# Altium project STEP_DRIVER_V3.0.PrjPcb (part 2 of 2)
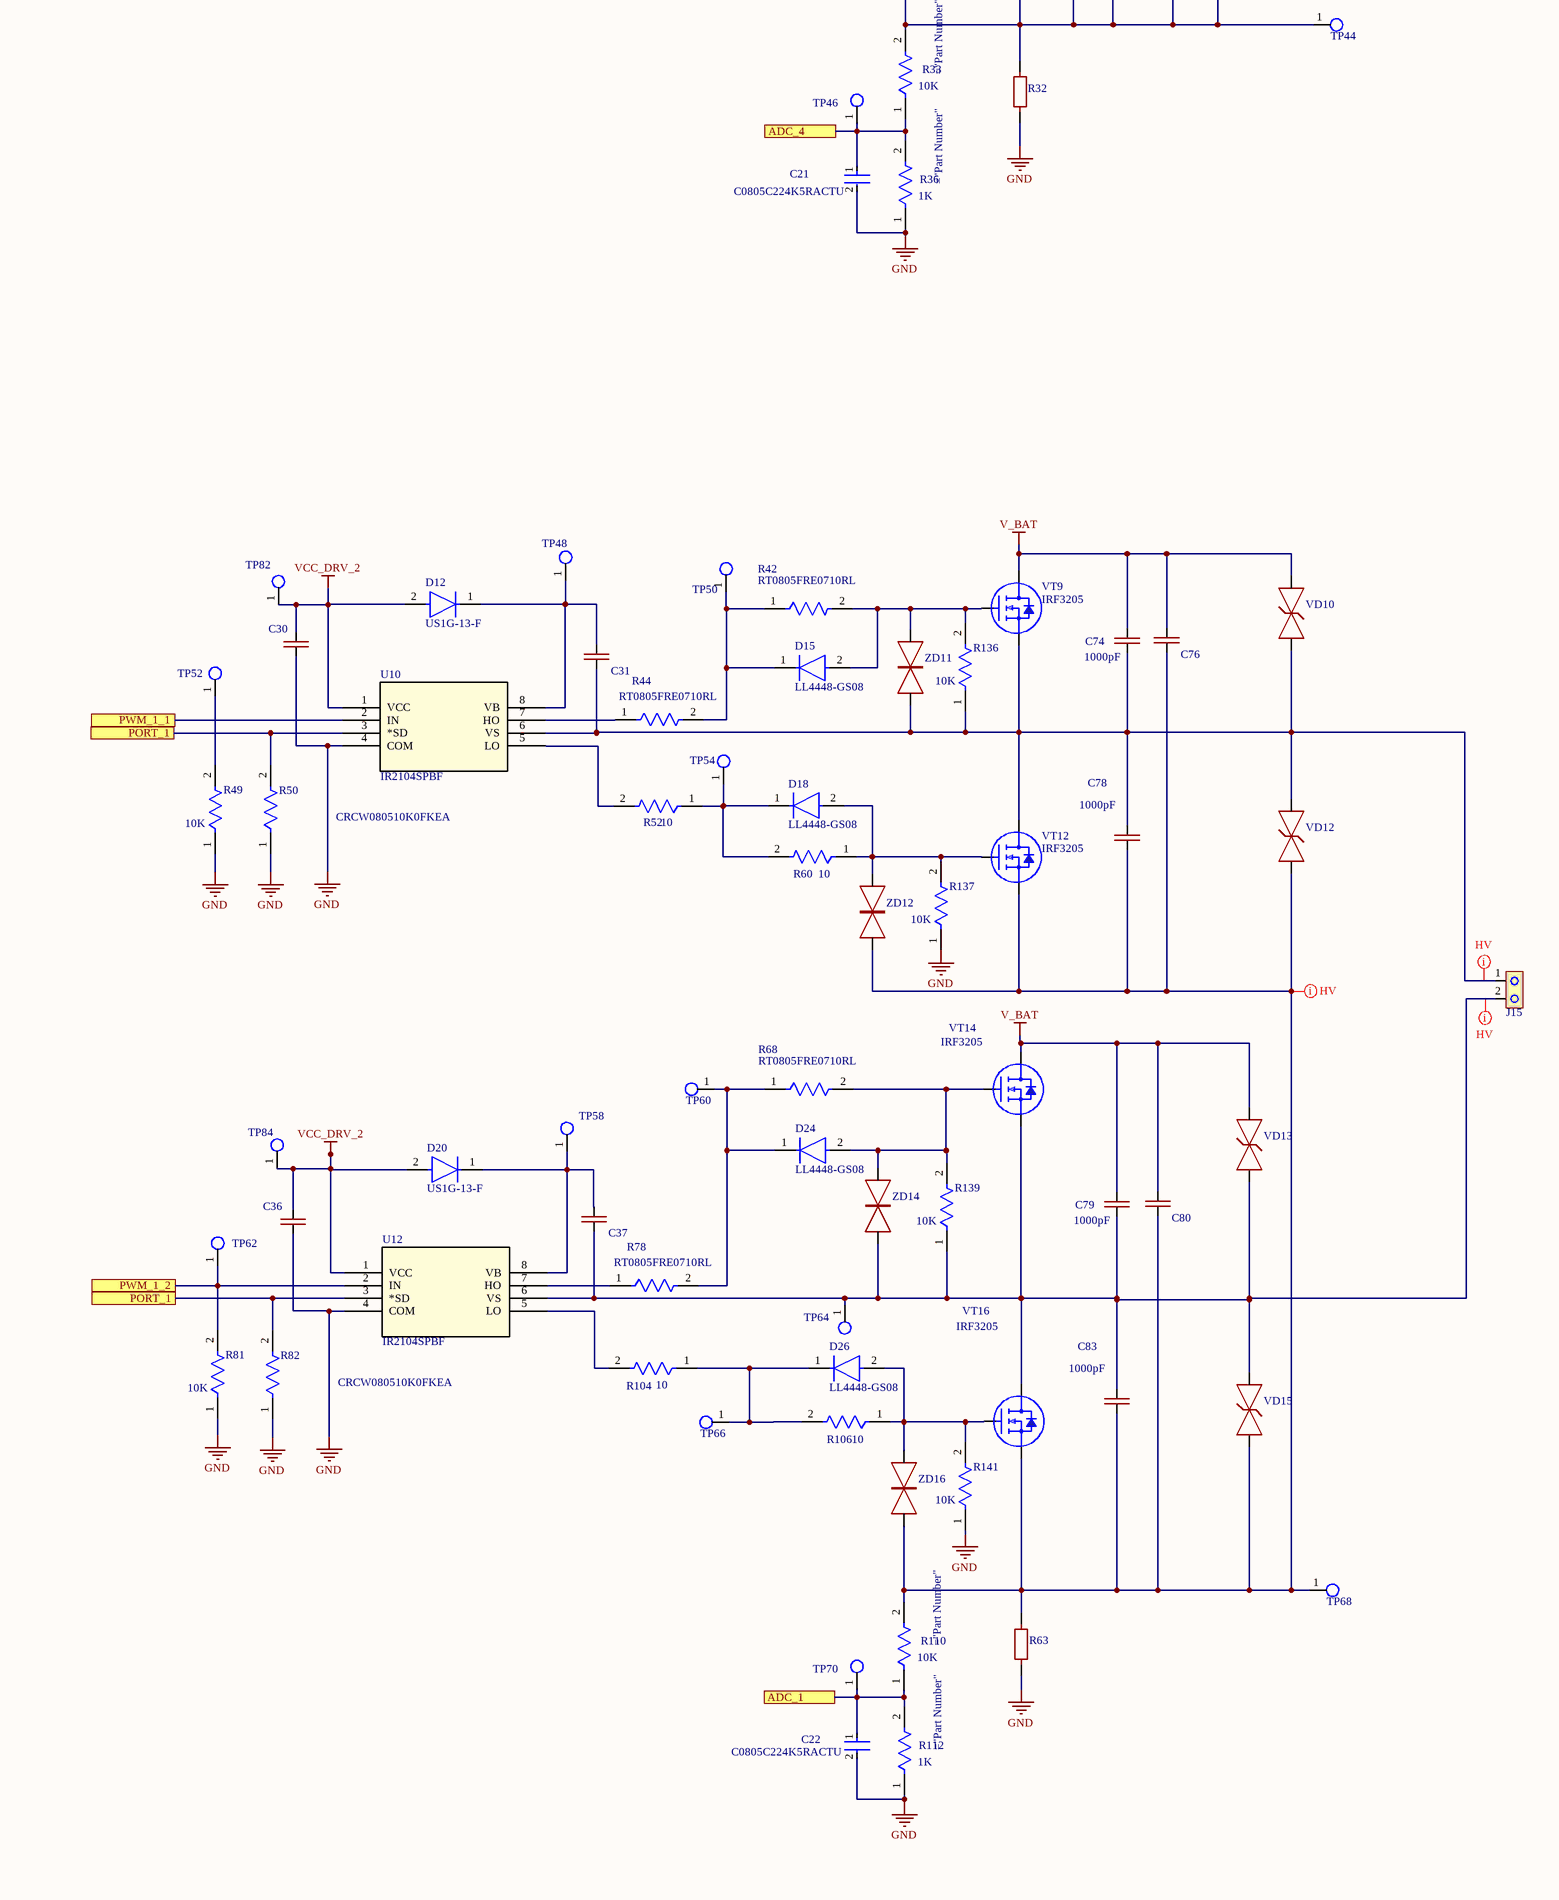
[diagram p8: STEP_DRIVER_V3.0.SchDoc, bottom column 4 of 4]

## Sheet STEP_DRIVER_V3.0.SchDoc (continued)

### Notes on the sheet
- (in symbol ACS758) VCC
- (in symbol CMP-05427-000015-1) +
- (in symbol MCP6001T) +; -

### Library data of the parts
C1 C2 C45 C57 C58 C90 C91 = 1000uF_10V_Size_F
C3 = CMP-05427-000015-1: CAP ALUM 100UF 20% 50V SMD; Manufacturer: Panasonic; Automotive Grade: Grade 3; Leakage Current: 100uA; Dissipation Factor: 0.12%; Life: 2000Hours; Ripple Current: 200mA; Material: Aluminum; ComponentLink2Description: Datasheet; Category: Cap; Voltage Rating: 50V; Value: 100uF; Octopart: https://octopart.com/eee-1ha101up-panasonic-55396734; Digikey Description: CAP ALUM 100UF 20% 50V SMD; Package: SF; RoHS: TRUE; Height: 10.5mm; ComponentLink2URL: https://industrial.panasonic.com/cdbs/www-data/pdf/RDE0000/ABA0000C1145.pdf; Tolerance: 20%; Mouser Description: Cap Aluminum Lytic 100uF 50V 20% (8 X 10.2mm) SMD 200mA 2000h 85C Automotive T/R; Device Class L2: Capacitors; Temperature Range High: +85°C; Lead Free: Yes; Device Class L3: Aluminum Electrolytic Capacitors; Device Class L1: Passive Components; Manufacturer Part Number: EEE-1HA101UP; Temperature: -40°C to +85°C; Automotive: Yes; Capacitance: 100uF; Voltage: 50V; Temperature Range Low: -40°C
C4 C5 C88 = CAP-POLAR
C6 C61-C64 = 293D106X9050E2TE3: Capacitor Polarised; Manufacturer_Name: Vishay; Height: 4.3mm; Manufacturer_Part_Number: 293D106X9050E2TE3; Mouser Part Number: 74-293D106X9050E2TE3; Arrow Part Number: 293D106X9050E2TE3
  C6: Datasheet Link: http://www.vishay.com/doc?40002; Mouser Price/Stock: https://www.mouser.com/Search/Refine.aspx?Keyword=74-293D106X9050E2TE3; Arrow Price/Stock: https://www.arrow.com/en/products/293d106x9050e2te3/vishay
  C61-C64: Datasheet Link: http://www.vishay.com/docs/40002/293d.pdf; Mouser Price/Stock: https://www.mouser.co.uk/ProductDetail/Vishay-Sprague/293D106X9050E2TE3?qs=N31o%252Bt096gu9lsvzLRhHsg%3D%3D; Arrow Price/Stock: https://www.arrow.com/en/products/293d106x9050e2te3/vishay?region=nac
C7 C33 C48 C55 C56 C60 C70 C72-C74 C77-C79 C81 C83 C84 C86 C87 = CAP-NON-POLAR
C8 C10 C17-C23 C26-C28 C40 C46 C49 C51 C53 C59 C65-C68 C85 C89 C92-C96 = CMP-1036-04552-2: CAP CER 0.22UF 50V X7R 0805; Manufacturer: KEMET; Value: 0.22 μF; Temperature Coefficient: 30ppm/°C; Material: Ceramic; Tolerance: 0.1; ComponentLink2URL: https://content.kemet.com/datasheets/KEM_C1003_C0G_SMD.pdf; Temperature Characteristic: X7R; Device Class L3: Ceramic Capacitors; Lead Free: Yes; Temperature: -55°C to +125°C; RoHS: TRUE; Capacitance: 0.22 μF; Automotive: No; Octopart: https://octopart.com/c0805c224k5ractu-kemet-144670; Manufacturer Part Number: C0805C224K5RACTU; Temperature Range Low: -55°C; Height: 0.88mm; Device Class L1: Passive Components; Digikey Description: CAP CER 0.22UF 50V X7R 0805; ComponentLink2Description: Datasheet; Mouser Description: CAP CER 0.22UF 50V X7R 0805; Category: Cap; Ipc Land Pattern Name: CAPC200125X78; Temperature Range High: +125°C; Package: C0805C-DN; Device Class L2: Capacitors; Voltage Rating: 50 V
C42 = CMP-00287-17080245-1: ECQ-E2224JFW ECQE, Met Polyester Film Cap Radial Lead 250VDC, 0.22uF, 5%, L/S =10mm, Blk CRMP; Capacitance: 220nF; Voltage Rating (DC): 250V; Dielectric: PET; NexarPartId: 17080245; Width: 5.5118mm; Length: 11.9888mm; Min Operating Temperature: -40°C; Termination: Radial; Height - Seated (Max): 15.494mm; Max Operating Temperature: 105°C; Lead Pitch: 10mm; Mount: Through Hole; RoHS: Compliant; Dielectric Material: Polyester; Tolerance: 5%; Case/Package: Radial
C43 = CMP-1036-04552-2: CAP CER  2.2UF 50V X7R 0805; Manufacturer: KEMET; Manufacturer Part Number: C0805C224K5RACTU; Value: 0.22 μF; Temperature Coefficient: 30ppm/°C; Material: Ceramic; Tolerance: 0.1; ComponentLink2URL: https://content.kemet.com/datasheets/KEM_C1003_C0G_SMD.pdf; Temperature Characteristic: X7R; Device Class L3: Ceramic Capacitors; Lead Free: Yes; Temperature: -55°C to +125°C; RoHS: TRUE; Capacitance: 0.22 μF; Automotive: No; Octopart: https://octopart.com/c0805c224k5ractu-kemet-144670; Temperature Range Low: -55°C; Height: 0.88mm; Device Class L1: Passive Components; Digikey Description: CAP CER 0.22UF 50V X7R 0805; ComponentLink2Description: Datasheet; Mouser Description: CAP CER 0.22UF 50V X7R 0805; Category: Cap; Ipc Land Pattern Name: CAPC200125X78; Temperature Range High: +125°C; Package: C0805C-DN; Device Class L2: Capacitors; Voltage Rating: 50 V
C44 = CMP-1036-04552-2: CAP CER 2.2UF 50V X7R 0805; Manufacturer: KEMET; Manufacturer Part Number: C0805C224K5RACTU; Value: 0.22 μF; Temperature Coefficient: 30ppm/°C; Material: Ceramic; Tolerance: 0.1; ComponentLink2URL: https://content.kemet.com/datasheets/KEM_C1003_C0G_SMD.pdf; Temperature Characteristic: X7R; Device Class L3: Ceramic Capacitors; Lead Free: Yes; Temperature: -55°C to +125°C; RoHS: TRUE; Capacitance: 0.22 μF; Automotive: No; Octopart: https://octopart.com/c0805c224k5ractu-kemet-144670; Temperature Range Low: -55°C; Height: 0.88mm; Device Class L1: Passive Components; Digikey Description: CAP CER 0.22UF 50V X7R 0805; ComponentLink2Description: Datasheet; Mouser Description: CAP CER 0.22UF 50V X7R 0805; Category: Cap; Ipc Land Pattern Name: CAPC200125X78; Temperature Range High: +125°C; Package: C0805C-DN; Device Class L2: Capacitors; Voltage Rating: 50 V
C47 C50 C52 C54 = CMP-1036-04552-2: CAP CER 0.22UF 50V X7R 0805; Manufacturer: KEMET; Manufacturer Part Number: C0805C224K5RACTU; Value: 0.22 μF; Temperature Coefficient: 30ppm/°C; Material: Ceramic; Tolerance: 0.1; ComponentLink2URL: https://content.kemet.com/datasheets/KEM_C1003_C0G_SMD.pdf; Temperature Characteristic: X7R; Device Class L3: Ceramic Capacitors; Lead Free: Yes; Temperature: -55°C to +125°C; RoHS: TRUE; Capacitance: 0.22 μF; Automotive: No; Octopart: https://octopart.com/c0805c224k5ractu-kemet-144670; Temperature Range Low: -55°C; Height: 0.88mm; Device Class L1: Passive Components; Digikey Description: CAP CER 0.22UF 50V X7R 0805; ComponentLink2Description: Datasheet; Mouser Description: CAP CER 0.22UF 50V X7R 0805; Category: Cap; Ipc Land Pattern Name: CAPC200125X78; Temperature Range High: +125°C; Package: C0805C-DN; Device Class L2: Capacitors; Voltage Rating: 50 V
D1 D2 D6 D10-D12 D19 D20 = CMP-12791-000009-1: DIODE GEN PURP 400V 1A SMA; Manufacturer: Diodes Inc.; Max Surge Forward Current: 30A; Peak Reverse Current: 5uA; Standoff Height: 0.05mm; Value: 20pF; Max Junction Temp: +150°C; Digikey Description: DIODE GEN PURP 400V 1A SMA; ComponentLink2URL: https://www.diodes.com/assets/Datasheets/ds16008.pdf; Device Class L1: Discrete Semiconductors; Mouser Description: Rectifiers 400V 1A; Manufacturer Part Number: US1G-13-F; Package: SMA; Height: 2.4mm; Automotive: No; Temperature Range High: +150°C; RoHS: TRUE; Lead Free: Yes; Temperature: -65°C to +150°C; Category: Diode; Octopart: https://octopart.com/us1g-13-f-diodes+inc.-334651; Temperature Range Low: -65°C; Forward Current: 1A; Footprint Url: https://www.diodes.com/assets/Package-Files/SMA.pdf; ComponentLink2Description: Datasheet; Reverse Voltage: 400V; Capacitance: 20pF; Device Class L3: Rectifier Diodes; Max Repetitive Reverse Voltage: 400V; Device Class L2: Diodes
D3-D5 D7-D9 D13-D18 D21 D24-D27 = CMP-249167-000001-1: DIODE GEN PURP 75V 150MA SOD80; Manufacturer: Vishay Small Signal; Max Junction Temp: +175°C; Automotive Grade: Grade 0; Capacitance: 4pF; Peak Reverse Current: 5uA; Forward Current: 300mA; Max Repetitive Reverse Voltage: 100V; Max Surge Forward Current: 2A; Value: 4pF; ComponentLink2Description: Datasheet; Height: 1.6mm; ComponentLink2URL: http://www.vishay.com/docs/85557/ll4148.pdf; Category: Diode; Lead Free: Yes; Device Class L3: Rectifier Diodes; Reverse Voltage: 75V; Mouser Description: Diodes - General Purpose, Power, Switching 100 Volt 100mA; RoHS: TRUE; Temperature: to +175°C; Automotive: Yes; Octopart: https://octopart.com/ll4448-gs08-vishay+small+signal-40886; Digikey Description: DIODE GEN PURP 75V 150MA SOD80; Manufacturer Part Number: LL4448-GS08; Temperature Range High: +175°C; Device Class L1: Discrete Semiconductors; Device Class L2: Diodes; Package: 6.560-5005.01-4
D22 D28-D31 = 151031YS06000: WURTH ELEKTRONIK - 151031YS06000 - LED, Yellow, Through Hole, T-1 (3mm), 30 mA, 2 V, 590 nm; Geometry.Height: 5.5mm; Manufacturer_Name: Wurth Elektronik; Manufacturer_Part_Number: 151031YS06000; Mouser Part Number: 710-151031YS06000; Mouser Price/Stock: https://www.mouser.co.uk/ProductDetail/Wurth-Elektronik/151031YS06000?qs=LlUlMxKIyB3xSYYW%252BcuBiQ%3D%3D; Arrow Part Number: *; Arrow Price/Stock: *; Mouser Testing Part Number: *; Mouser Testing Price/Stock: *; Datasheet Link: https://katalog.we-online.de/led/datasheet/151031YS06000.pdf
D23 = LMV358AIDR: Микросхема сдвоенный ОУ; ComponentDescription: =ComponentTypе+', '+Comment+', '+Package; ComponentTypе: Микросхема сдвоенный ОУ; Package: 8-SOIC
D32 = CMP-02541-000001-1: DIODE ZENER 15V 1.3W DO41; Manufacturer: Vishay; Max Reverse Leakage Current: 0.5uA; Reverse Voltage: 11V; Max Zener Voltage: 15.6V; Zener Impedance: 15Ω; Max Junction Temp: +175°C; Power Dissipation: 1300mW; Automotive Grade: Grade 0; Device Class L3: Zener Diodes; Device Class L1: Discrete Semiconductors; Automotive: Yes; Mouser Description: Zener Diodes 15 Volt 1.3 Watt 5%; Lead Free: Yes; Height: 2.6mm; Octopart: https://octopart.com/bzx85c15-tap-vishay-55401762; Temperature: to +175°C; Digikey Description: DIODE ZENER 15V 1.3W DO41; ComponentLink2URL: http://www.vishay.com/docs/85607/bzx85.pdf; Device Class L2: Diodes; RoHS: TRUE; Temperature Range High: +175°C; ComponentLink2Description: Datasheet; Package: 6.561-5001.02-4; Manufacturer Part Number: BZX85C15-TAP; Category: Diode; Nom Zener Voltage: 15V
D33 = CMP-14400-000025-1: DIODE ZENER 5.1V 300MW SOD323
J1 J2 J4 J13 = 691101710002: WR-TBL Series 101 Horizontal Entry Modular, THT, pitch 5mm, 2p; Manufacturer: Wurth Elektronik; Modularity: Yes; Rated Current: 16A; Working Voltage: 250V; ComponentLink1Description: Website Link; ComponentLink1URL: https://www.we-online.com/redexpert/article/691101710002?ad; ComponentLink2Description: Datasheet Link; ComponentLink2URL: https://www.we-online.com/redexpert/spec/691101710002?ad; Manufacturer Part Number: 691101710002; Category: Terminal Blocks; Match Code: WR-TBL; Mount: Through Hole; Operating Temperature Max: 105°C; Operating Temperature Min: -40°C; Packaging: Box; Application: Pressure Clamp; Number of Pins: 2; Number of Rows: 1; Orientation: Horizontal; Pitch: 5mm
J3 J8-J10 J15 = Connector_Tianli_T-800
J5 = 691101710003: WR-TBL Series 101 Horizontal Entry Modular, Through Hole, pitch 5mm, 3p; Manufacturer: Wurth Elektronik; Pin Number: 3; Rated Current: 16A; Working Voltage: 250V; PCB/Cable/Panel: PCB; Modularity: Yes; ComponentLink1Description: Manufacturer Link; ComponentLink1URL: https://www.we-online.com/redexpert/article/691101710003?ad; ComponentLink2Description: Datasheet; ComponentLink2URL: https://www.we-online.com/redexpert/spec/691101710003?ad; Category: Terminal Blocks; Match Code: WR-TBL; Manufacturer Part Number: 691101710003; Mount: Through Hole; Operating Temperature Max: 105°C; Operating Temperature Min: -40°C; Packaging: Box; Pitch: 5mm; Orientation: Horizontal; Application: Pressure Clamp
L1 L4-L9 = CMP-0227-00501-2: NexarPartId: 24533346; Inductance: 270µH; Current Rating: 620mA; Self Resonant Frequency: 4MHz; DC Resistance (DCR): 500mΩ; Ambient Temperature Range Low: -40°C; Min Operating Temperature: -40°C; RoHS: Compliant; Ambient Temperature Range High: 85°C; Packaging: Digi-Reel®; Height: 5.4mm; Length: 9mm; Max Operating Temperature: 125°C; Width: 10mm
LED3 LED4 = 151033BS03000: THT LED round mono-color waterclear, WL-TMRW , Blue; Manufacturer: Wuerth Elektronik; ComponentLink1Description: Manufacturer URL; ComponentLink2Description: Datasheet; ComponentLink1URL: http://www.we-online.com; ComponentLink2URL: http://katalog.we-online.de/pbs/datasheet/7448042001.pdfhttp://katalog.we-online.de/pbs/datasheet/7448042001.pdfhttp://katalog.we-online.de/pbs/datasheet/7448042001.pdfhttp://katalog.we-online.de/pbs/datasheet/151033BS03000.pdf; PartNumber: 151033BS03000; Emitting color: Blue; PackageReference: Type 3mm
P1 = CMP-1024-00357-1: 0.025" SQ Post Header, Through-hole, Vertical, -55 to 125 degC, 2.54 mm Pitch, 4-Pin, Male, RoHS; Manufacturer: Samtec; Pitch: 2.54 mm; RoHS: True; ComponentLink3URL: http://www.samtec.com/documents/webfiles/cpdf/TSW-XXX-XX-XXX-X-XX-XXX-MKT.pdf; Mounting Technology: Through-hole; ComponentLink2URL: http://www.samtec.com/documents/webfiles/pdf/TSW_TH.PDF; ComponentLink1URL: http://www.samtec.com; ComponentLink3Description: Package Specification; PackageVersion: DM, 8/1988; ComponentLink2Description: Datasheet; PackageReference: TSW-104-08-X-S; PackageDescription: .025[0.64] SQ. Post Terminal Strip Assembly; PartNumber: TSW-104-08-G-S; ComponentLink1Description: Manufacturer URL; Temperature Range: -55 to 125 degC; DatasheetVersion: F-214; Orientation: Vertical
P2 P4 P8-P11 = 61900311121: WR-WTB THT Male Vertical Locking Header, pitch 2.54mm, 3p; Pin Number: 3; Contact Resistance: 20mOhm; Rated Current: 3A; Withstanding Voltage: 1000VAC; Working Voltage: 250VAC; ComponentLink1Description: Manufacturer; ComponentLink1URL: http://www.we-online.de; ComponentLink2Description: Datasheet; ComponentLink2URL: https://www.we-online.com/catalog/datasheet/61900311121.pdf; Pitch: 2.54mm; Published Date: January 2020; Publisher: Wurth Elektronik; Mounting Technology: THT; Packaging: Bag; Operating Temperature: -40 to +105degC; Part Number: 61900311121; Gender: Male; Type: Vertical
P12-P14 = 61300511121: WR-PHD Pin Header, THT, Vertical, pitch 2.54mm, 1 Row, 5P; Manufacturer: Wurth Elektronik; Contact Resistance: 20mΩ; Rated Current: 3A; Working Voltage: 250V; Withstanding Voltage: 500V; ComponentLink1Description: Website Link; ComponentLink1URL: https://www.we-online.com/redexpert/article/61300511121?ad; ComponentLink2Description: Datasheet Link; ComponentLink2URL: https://www.we-online.com/redexpert/spec/61300511121?ad; Manufacturer Part Number: 61300511121; Category: Board-to-Board Connectors; Match Code: WR-PHD; Mount: Through Hole; Operating Temperature Max: 105°C; Operating Temperature Min: -40°C; Packaging: Bag; Gender: Pin Header; Number of Pins: 5; Number of Rows: 1; Orientation: Vertical; Pitch: 2.54mm
R1 = RES-CONST
R2 R10 R15 R16 R25-R28 R45 R48 R51 R52 R59 R60 R83-R88 R93 R94 R97 R99-R106 = CRCW08050000Z0EA
  R15 R16 R25-R28 R45 R48 R51 R52 R59 R60 R83 R84 R103-R106: 100k: *
  R85-R88 R93 R94 R97 R99-R102: 10k: *
R3-R5 R8 R9 R20 R22 R30 R33 R35 R36 R38 R39 R54-R58 R61 R62 R69-R74 R76 R77 R89-R92 R95 R96 R108 R110 R112-R115 R119 R120 R122-R126 R143-R148 = RC0805FR-07100KL
R6 R7 R11 R14 R19 R21 R31 R34 R41-R44 R65 R68 R75 R78 = CMP-03412-028725-1: RES SMD 10 OHM 1% 1/8W 0805; Manufacturer: Yageo; Tolerance: 0.0001; Value: 10Ω; Temperature Coefficient: 50 ppm/°C; Voltage Rating: 150V; Power Rating: 0.125W; Package: RT0805; Lead Free: Yes; Manufacturer Part Number: RT0805FRE0710RL; Series: RT; Footprint Url: http://www.yageo.com/exep/pages/download/literatures/PYu-R_Mount_10.pdf; Temperature Range High: +155°C; Temperature Range Low: -55°C; Octopart: https://octopart.com/rt0805fre0710rl-yageo-39855890; Height: 0.6mm; Device Class L1: Passive Components; Mouser Description: High Precision-High Stability Chip Resistor Thin Film 0805 10Ohm 1% Paper T/R; ComponentLink2URL: http://www.yageo.com/documents/recent/PYu-RT_1-to-0.01_RoHS_L_9.pdf; Device Class L2: Resistors; Composition: Thin Film; Device Class L3: Chip SMD Resistors; Automotive: No; RoHS: TRUE; Ipc Land Pattern Name: RESC200125X50; Temperature: -55°C to +155°C; ComponentLink2Description: Datasheet; Resistance: 10Ω; Category: Res; Digikey Description: RES SMD 10 OHM 1% 1/8W 0805
R12 R13 R17 R18 R23 R24 R37 R40 R46 R47 R49 R50 R79-R82 R98 R116-R118 R127-R142 = CMP-2001-04908-2: RES Thick Film, 10kΩ, 1%, 0.125W, 100ppm/°C, 0805; Resistance: 10kR; Voltage Rating (DC): 150V; Power Rating: 125mW; Weight: 0.000194oz; Package Quantity: 5000; Military Standard: Not; Max Operating Temperature: 155°C; Temperature Coefficient: 100ppm/°C; Contact Plating: Tin; Width: 1.25mm; Height: 0.45mm; Radiation Hardening: No; Tolerance: 1%; Min Operating Temperature: -55°C; Voltage Rating: 150V; Length: 2mm; Depth: 1.25mm; Termination: SMD/SMT; Packaging: Tape and Reel; Case/Package: 0805; Case Code (Metric): 2012; Lead Free: Lead Free; Case Code (Imperial): 0805; Composition: Thick Film
R53 = RC0805FR-07100KL: 10K
R111 = RC0805FR-07100KL: 2.2K
R121 = RC0805FR-07100KL: 220
RG1 = Reg_Fairchild_LM7805CT_eec: REG IC REG LINEAR 5V 1A TO220AB; Voltage Dropout (Max): 2V @ 1A (Typ); Voltage - Input (Max): 35V; helpURL: https://upverter.com/upn/revision/b27a7358b7dd93a3/; ComponentLink2Description: Datasheet; Temperature: -40°C to +125°C; Package: TO220; Supplier 2: Mouser; Price: 0.384521982769; Supplier 1: Digi-Key; ComponentLink1URL: https://upverter.com/upn/revision/b27a7358b7dd93a3/; Supplier Part Number 2: 512-LM7805CT; Supplier Part Number 1: LM7805CT-ND; Manufacturer: Fairchild; ComponentLink1Description: Upverter; ComponentLink2URL: https://www.fairchildsemi.com/datasheets/LM/LM7805.pdf; RoHS: TRUE; Mouser Part Number: 512-LM7805CT; Ipc Land Pattern Name: TO-220; Temperature Range High: +125°C; Digikey Description: REG IC REG LINEAR 5V 1A TO220AB; Digikey Part Number: LM7805CT-ND; Lead Free: yes; Temperature Range Low: -40°C; Voltage - Output: 5V; Current-Output: 1A
RP6-RP9 = 3296W-1-202LF
SW1-SW3 = 4-1437565-2: No Description Available; Mfr_Name: TE Connectivity; Copyright: Copyright (C) 2022 Ultra Librarian. All rights reserved.; Manufacturer_Part_Number: 4-1437565-2; RefDes: RefDes; Type: DEV
TP1-TP40 TP42-TP90 = TP_PCB?: Test_Point
U1 = CMP-0062-01639-4: 800mA Low-Dropout Linear Regulator, 4-pin SOT-223, Pb-Free; Manufacturer: Texas Instruments; High-Reliability: Y; PowerWise: N; PackageTopMarking: XYTT*N05A; CompType: LDO IC; ComponentLink1URL: http://www.ti.com/general/docs/lit/getliterature.tsp?genericPartNumber=LM1117-N&fileType=pdf; PartNumber: LM1117MPX-3.3/NOPB; ComponentLink1Description: Datasheet URL; PinCount: 4; Code_JEDEC: TO-261-AA; PackageDescription: Molded SOT-223, 6.50 x 3.56 x 1.6mm Body, 4 Lead, 2.3mm Pitch; PackageReference: DCY0004A; RoHS: Y; Code_IPC: SOT223-4
U2 = B0505s-1W: DC DC Converter 5V 1W
U3 = CMP-0534-00565-1: Quad Channel Digital Isolator, 2.5 KV rms Insulation Rating, 10 Mbps Data Rate, 50 ns Delay, Industrial, 16-pin SOIC (RW-16), Tube; Manufacturer: Analog Devices; Max Data Rate: 10Mbps; ComponentLink2URL: http://www.analog.com/static/imported-files/data_sheets/ADuM1400_1401_1402.pdf; ComponentLink5Description: URL Link2; ComponentLink3URL: http://www.analog.com/static/imported-files/packages/PKG_PDF/SOIC_WIDE%20%28RW%29/RW_16.pdf; DatasheetVersion: Rev. H; ComponentLink2Description: Datasheet; ComponentLink3Description: Package Specification; PartNumber: ADUM1401BRWZ; ComponentLink5URL: Reference Circuit:http://www.analog.com/en/interface-isolation/digital-isolators/adum1401/products/product.html#product-recommendations; Max Operating Temp (degreesC): 125; PackageReference: RW-16; PackageVersion: 032707-B, 03/2007; ComponentLink1Description: Manufacturer URL; Code_JEDEC: MS-013-AA; PackageDescription: 16-Pin Standard Small Outline Package, Body 10.3 x 7.5 mm, Pitch 1.27 mm; Mounting Technology: Surface Mount; ComponentLink1URL: http://www.analog.com/en/index.html; ComponentLink4Description: URL Link1; ComponentLink4URL: Product URL:http://www.analog.com/en/interface-isolation/digital-isolators/adum1401/products/product.html
U4 = STM32F303CCT6: No Description Available; Mfr_Name: STMicroelectronics; RefDes: RefDes; Type: Type
U5-U12 = IR2104SPBF: No Description Available; Mfr_Name: Infineon; Copyright: Copyright (C) 2023 Ultra Librarian. All rights reserved.; Manufacturer_Part_Number: IR2104SPBF; RefDes: RefDes; Type: DEV
U14-U17 = MCP6001T
VD17 = ZENER
VT1-VT16 = IRF3205: Транзистор МОП, одиночный, N-канальный; ComponentDescription: =ComponentType+', '+ChannelType+', '+Comment+', '+Package; ChannelType: N-канальный; ComponentType: Транзистор МОП, одиночный; Package: TO-220(bend2)